# EasyEDA Pro project vector-06-easyeda.epro

# Schematic Schematic1
Board Name: Board1; Create Date: 2026-05-24; Page Name: P1; Project Name: odin8266; Schematic Name: Schematic1; Update Date: 2026-06-03; Company: EasyEDA.com; Page Size: A4; Version: V1.0
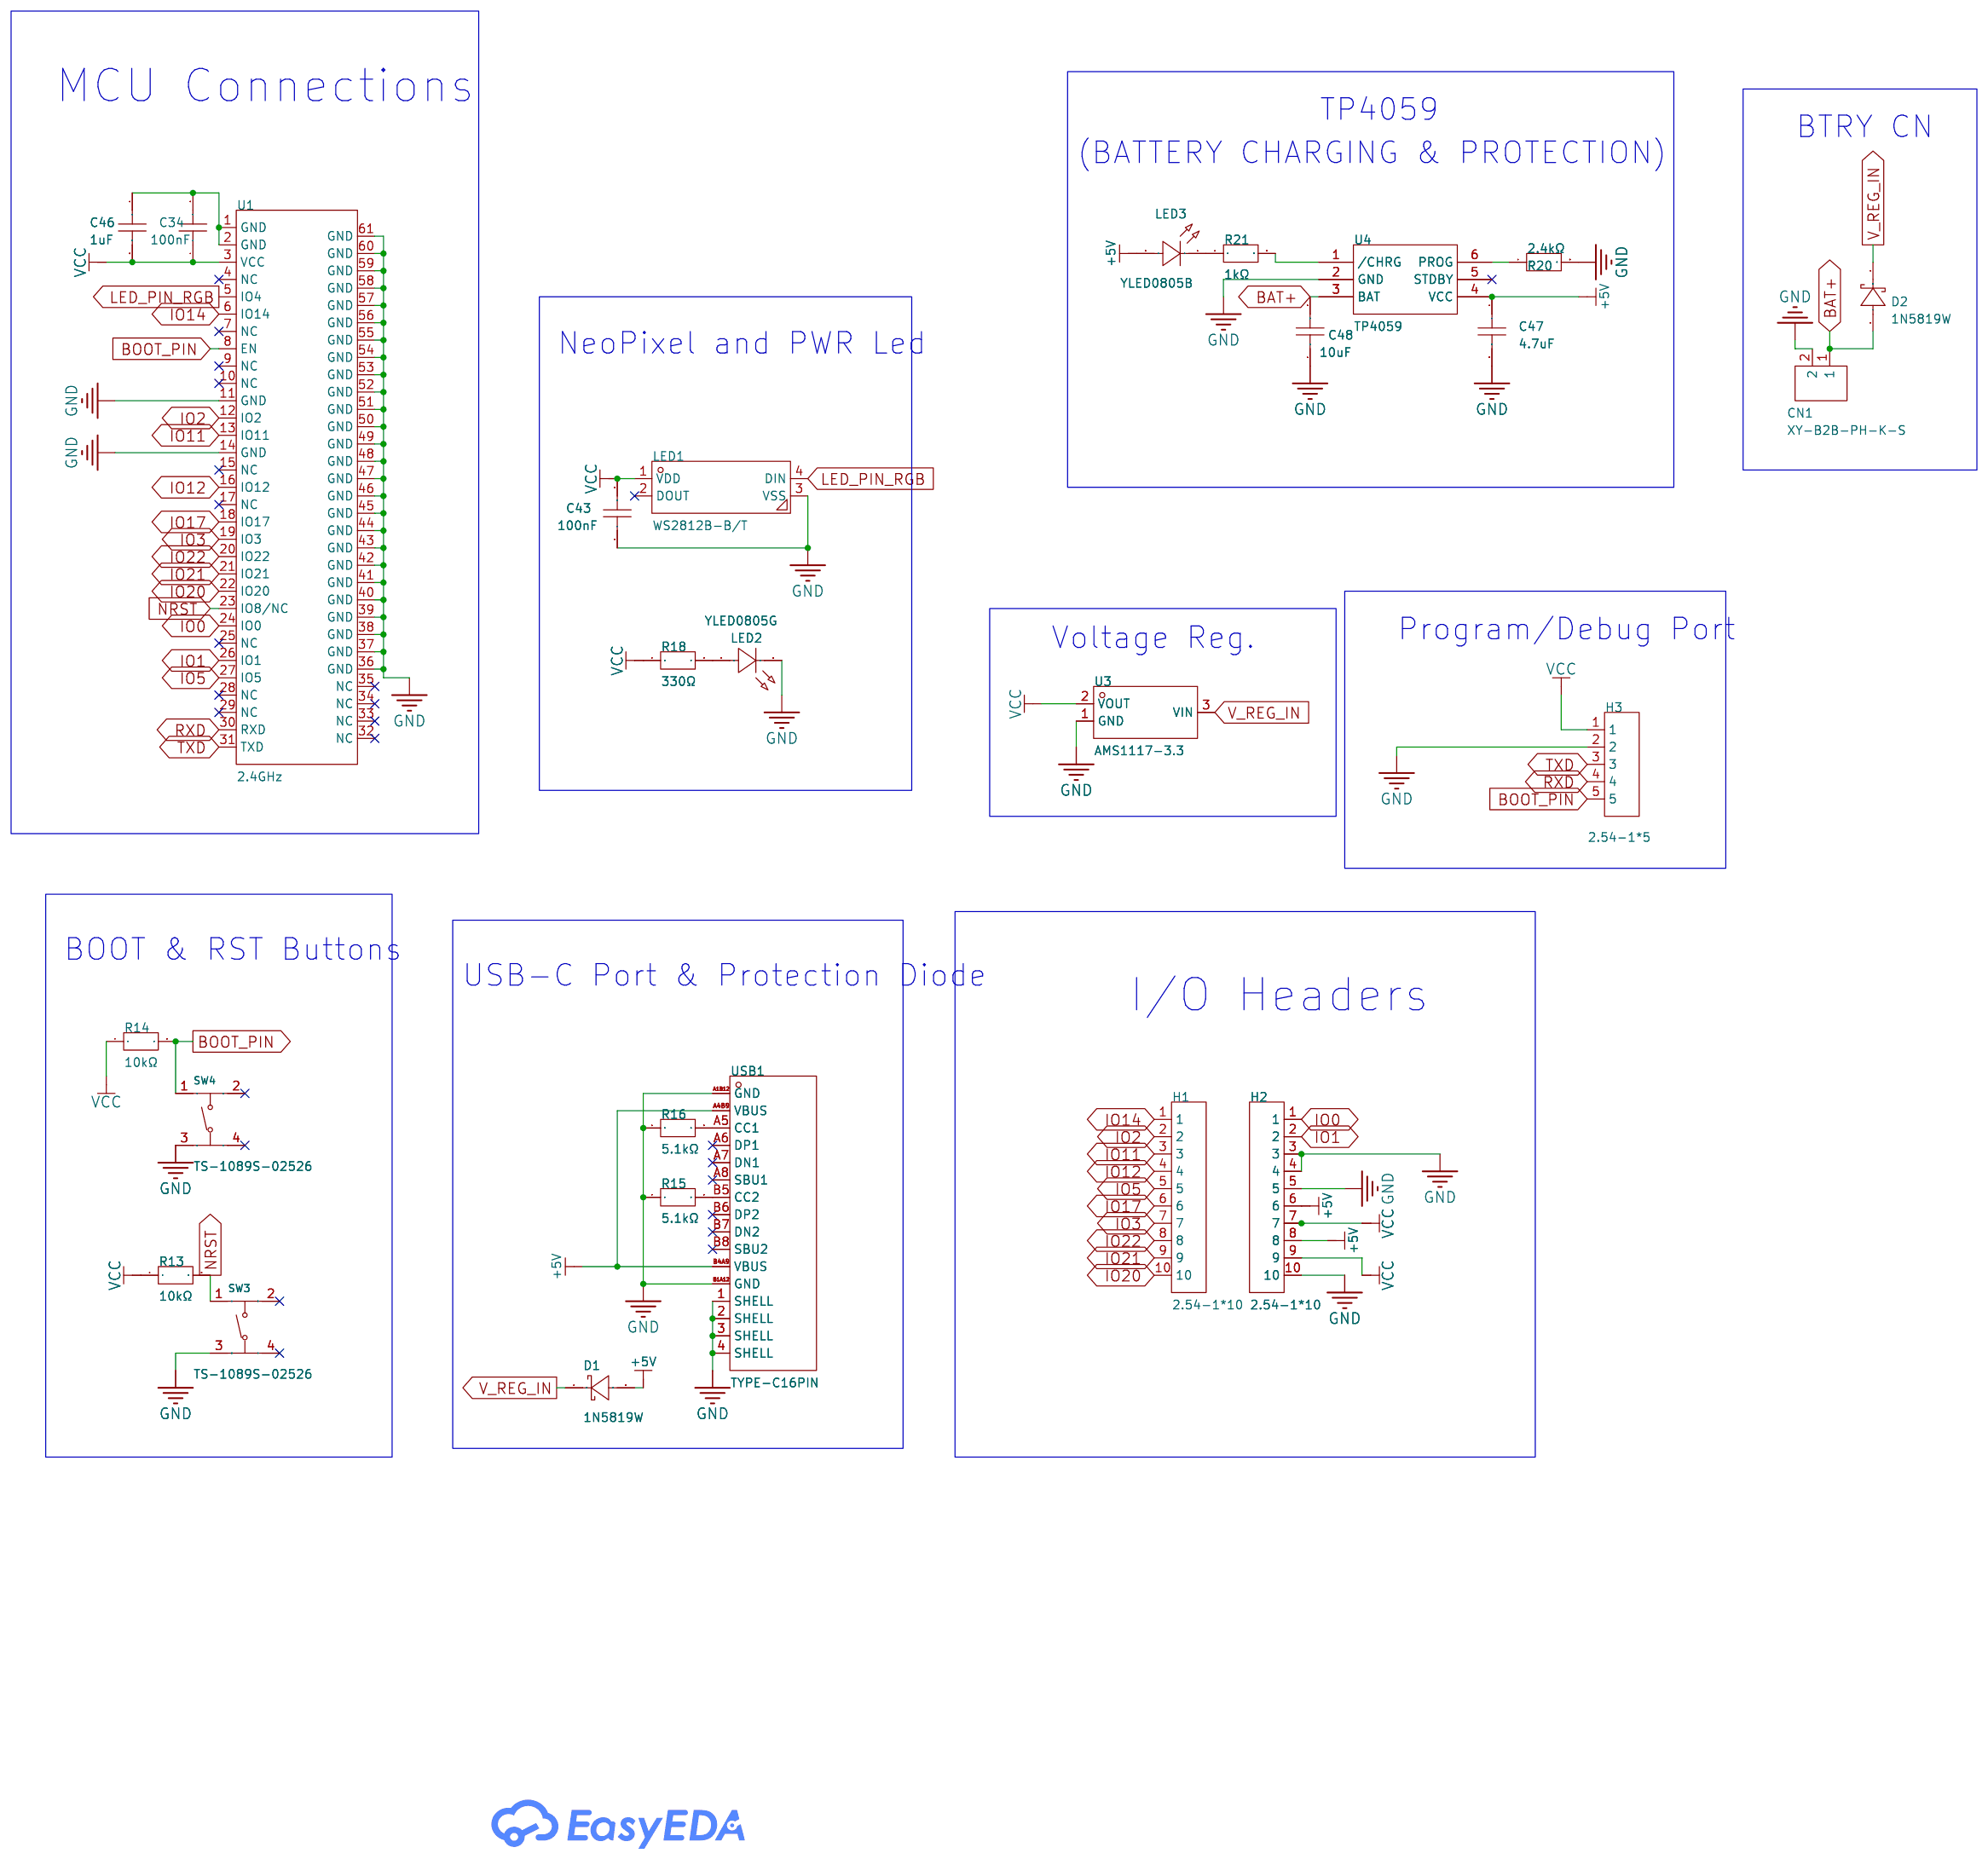
[diagram p0: schematic sheet]

## Parts
C34  100nF  [C0603]
C43  100nF  [C0603]
C46  1uF  [C0603]
C47  4.7uF  [C0603]
C48  10uF  [C0603]
CN1  XY-B2B-PH-K-S  [CONN-TH_B2B-PH-K-S]
D1  1N5819W  [SOD-123_L2.7-W1.6-LS3.7-RD]
D2  1N5819W  [SOD-123_L2.7-W1.6-LS3.7-RD]
H1  2.54-1*10  [HDR-TH_10P-P2.54-V-M]
H2  2.54-1*10  [HDR-TH_10P-P2.54-V-M]
H3  2.54-1*5  [HDR-TH_5P-P2.54-V-M]
LED1  WS2812B-B/T  [LED-SMD_4P-L5.0-W5.0-TL_WS2812B-B]
LED2  YLED0805G  [LED0805-FD-GREEN]
LED3  YLED0805B  [LED0805-RD]
R13  10kΩ  [R0603]
R14  10kΩ  [R0603]
R15  5.1kΩ  [R0603]
R16  5.1kΩ  [R0603]
R18  330Ω  [R0603]
R20  2.4kΩ  [R0603]
R21  1kΩ  [R0603]
SW3  TS-1089S-02526  [SW-SMD_4P-L4.2-W3.3-P2.15-LS5.1]
SW4  TS-1089S-02526  [SW-SMD_4P-L4.2-W3.3-P2.15-LS5.1]
U1  2.4GHz  [WIFIM-SMD_61P-CUSTOMBRUH]
U3  AMS1117-3.3  [SOT-223-3_L6.5-W3.4-P2.30-LS7.0-BR-1]
U4  TP4059  [SOT-23-6_L2.9-W1.6-P0.95-LS2.8-BR]
USB1  TYPE-C16PIN  [USB-C-SMD_TYPE-C16PIN]

## Library data of the parts
C34 C43 = FCC0603B104K500CT: Capacitance:100nF Tolerance:±10% Tolerance:±10% Voltage Rating:50V Temperature Coefficient:X7R; LCSC Part Name: 100nF ±10% 50V; Supplier Part: C5137636; Manufacturer: FOJAN(富捷); Supplier Footprint: 0603; JLCPCB Part Class: Extended Part; Datasheet: https://item.szlcsc.com/datasheet/FCC0603B104K500CT/5747088.html; Supplier: LCSC; Tolerance: ±10%; Voltage Rating: 50V; Temperature Coefficient: X7R
C46 = CGA0603X5R105K500JT: Capacitance:1uF Tolerance:±10% Tolerance:±10% Voltage Rating:50V Temperature Coefficient:X5R; LCSC Part Name: 1uF ±10% 50V; Supplier Part: C6119852; Manufacturer: HRE(芯声); Supplier Footprint: 0603; JLCPCB Part Class: Extended Part; Datasheet: https://item.szlcsc.com/datasheet/CGA0603X5R105K500JT/7062558.html; Supplier: LCSC; Tolerance: ±10%; Voltage Rating: 50V; Temperature Coefficient: X5R
C47 = TCC0603X5R475K160CT: Capacitance:4.7uF Tolerance:±10% Tolerance:±10% Voltage Rating:16V Temperature Coefficient:X5R; LCSC Part Name: 4.7uF ±10% 16V; Supplier Part: C380325; Manufacturer: CCTC(三环); Supplier Footprint: 0603; JLCPCB Part Class: Extended Part; Datasheet: https://item.szlcsc.com/datasheet/TCC0603X5R475K160CT/352730.html; Supplier: LCSC; Tolerance: ±10%; Voltage Rating: 16V; Temperature Coefficient: X5R
C48 = TCC0603X5R106K100CT: Capacitance:10uF Tolerance:±10% Tolerance:±10% Voltage Rating:10V Temperature Coefficient:X5R; LCSC Part Name: 10uF ±10% 10V; Supplier Part: C380314; Manufacturer: CCTC(三环); Supplier Footprint: 0603; JLCPCB Part Class: Extended Part; Datasheet: https://item.szlcsc.com/datasheet/TCC0603X5R106K100CT/352719.html; Supplier: LCSC; Tolerance: ±10%; Voltage Rating: 10V; Temperature Coefficient: X5R
CN1 = XY-B2B-PH-K-S: Pins Structure:1x2P Pitch:2mm Mounting Type:- Reference Series:- Number of Pins:2P Number of Rows:1 Number of PINs Per Row:2 Row Spacing:- Current Rating:2A Contact Material:Brass Contact Plating:Tin Operating Temperature:-25℃~+85℃ Operating Temperature:-; LCSC Part Name: 1x2P 间距:2mm; Supplier Part: C51940125; Manufacturer: XYECONN(辛译); Supplier Footprint: 插件,P=2mm; JLCPCB Part Class: Extended Part; Supplier: LCSC; Pins Structure: 1x2P; Pitch: 2mm; Number of Pins: 2P; Number of Rows: 1; Number of PINs Per Row: 2; Current Rating: 2A; Contact Material: Brass; Contact Plating: Tin; Operating Temperature: -25℃~+85℃; Voltage Rating: 250V; Plastic Material: PA66; Flame Retardant Rating: UL94V-0; Color: White
D1 D2 = 1N5819W_C41431973: Diode Configuration:Independent Voltage - Forward(Vf@If):580mV@1A Voltage - DC Reverse(Vr):40V Current - Rectified:1A Reverse Leakage Current (Ir):50uA@40V Operating Junction Temperature Range:-65℃~+125℃ Operating Junction Temperature Range:-65℃~+125℃ Non; LCSC Part Name: 丝印SL，1A 电压:40V 电流:1A; Supplier Part: C41431973; Manufacturer: GOODWORK(固得沃克); Supplier Footprint: SOD-123; JLCPCB Part Class: Extended Part; Datasheet: https://item.szlcsc.com/datasheet/1N5819W/43290188.html; Supplier: LCSC; Diode Configuration: Independent; Voltage - Forward(Vf@If): 580mV@1A; Voltage - DC Reverse(Vr): 40V; Current - Rectified: 1A; Reverse Leakage Current (Ir): 50uA@40V; Operating Junction Temperature Range: -65℃~+125℃; Non-Repetitive Peak Forward Surge Current: 9A
H1 H2 = 2.54-1*10: Pin Structure:1x10P Pitch:2.54mm Circluar Pins/Square Pins:Pin Header Mounting Type:Through Hole Number of Rows:1 Number of Pins:10P Current Rating:2.5A Length of Mating Pin:6mm Insulation Height:2.54mm Length of End Connection Pin:3mm Contact Material:Br; LCSC Part Name: 1x10P 间距:2.54mm 方针 直插; Supplier Part: C5156617; Manufacturer: ZHOURI(洲日); Supplier Footprint: 插件,P=2.54mm; JLCPCB Part Class: Extended Part; Datasheet: https://item.szlcsc.com/datasheet/2.54-1*10/5790717.html; Supplier: LCSC; Pin Structure: 1x10P; Pitch: 2.54mm; Circluar Pins/Square Pins: Pin Header; Mounting Type: Through Hole; Number of Rows: 1; Number of Pins: 10P; Current Rating: 2.5A; Length of Mating Pin: 6mm; Insulation Height: 2.54mm; Length of End Connection Pin: 3mm; Contact Material: Brass; Contact Plating: Gold; Operating Temperature: -40℃~+105℃
H3 = 2.54-1*5: Pin Structure:1x5P Pitch:2.54mm Circluar Pins/Square Pins:Pin Header Mounting Type:Through Hole Number of Rows:1 Number of Pins:5P Current Rating:2.5A Length of Mating Pin:6mm Insulation Height:2.54mm Length of End Connection Pin:3mm Contact Material:Bras; LCSC Part Name: 1x5P 间距:2.54mm 方针 直插; Supplier Part: C5156614; Manufacturer: ZHOURI(洲日); Supplier Footprint: 插件,P=2.54mm; JLCPCB Part Class: Extended Part; Datasheet: https://item.szlcsc.com/datasheet/2.54-1*5/5790714.html; Supplier: LCSC; Pin Structure: 1x5P; Pitch: 2.54mm; Circluar Pins/Square Pins: Pin Header; Mounting Type: Through Hole; Number of Rows: 1; Number of Pins: 5P; Current Rating: 2.5A; Length of Mating Pin: 6mm; Insulation Height: 2.54mm; Length of End Connection Pin: 3mm; Contact Material: Brass; Contact Plating: Gold; Operating Temperature: -40℃~+105℃
LED1 = WS2812B-B/T: Wavelength:520nm；471nm；621nm Luminous Intensity:R:300mcd~500mcd；B:200mcd~300mcd；G:600mcd~1000mcd Fixed-Frequency Pwm Mode:2kHz Data Transmission Rate:800Kbit/s Voltage - Supply:- Voltage - Supply:- Quiescent Current:0.6mA Lens Color:- Peak Wavelength:G:52; LCSC Part Name: RGB三色; Supplier Part: C2761795; Manufacturer: worldsemi; Supplier Footprint: SMD5050-4P; JLCPCB Part Class: Extended Part; Datasheet: https://item.szlcsc.com/datasheet/WS2812B-B%252FT/2886707.html; Supplier: LCSC; Wavelength: 520nm；471nm；621nm; Luminous Intensity: R:300mcd~500mcd；B:200mcd~300mcd；G:600mcd~1000mcd; Fixed-Frequency Pwm Mode: 2kHz; Data Transmission Rate: 800Kbit/s; Quiescent Current: 0.6mA; Peak Wavelength: G:520nm；R:621nm；B:471nm; Length: 5mm; Width: 1.57mm; Height: 5.4mm
LED2 = YLED0805G: Lamp Holder Type:2mm x 1.25mm square LED Illumination Color:Emerald Green Voltage - Forward(Vf):2.4V~3.1V Voltage - Forward(Vf):2.4V~3.1V Power(Watts):70mW Forward Current:20mA Wavelength - Dominant:516nm~534nm Wavelength - Dominant:516nm~534nm Peak Wavel; LCSC Part Name: 发光管; Supplier Part: C25170728; Manufacturer: YONGYUTAI(永裕泰); Supplier Footprint: 0805; JLCPCB Part Class: Extended Part; Datasheet: https://item.szlcsc.com/datasheet/YLED0805G/26899175.html; Supplier: LCSC; Lamp Holder Type: 2mm x 1.25mm square LED; Illumination Color: Emerald Green; Voltage - Forward(Vf): 2.4V~3.1V; Power(Watts): 70mW; Forward Current: 20mA; Wavelength - Dominant: 516nm~534nm; Peak Wavelength: 525nm; Diode Configuration: Discrete Diode; Lens Color: Water Clear; Luminous Intensity: 430mcd; Viewing Angle: 120°; Operating Temperature: -40℃~+85℃
LED3 = YLED0805B: Lamp Holder Type:- Illumination Color:Blue Voltage - Forward(Vf):2.7V~3.1V Voltage - Forward(Vf):2.7V~3.1V Power(Watts):- Forward Current:25mA Wavelength - Dominant:457nm~475nm Wavelength - Dominant:457nm~475nm Peak Wavelength:- Diode Configuration:Discre; LCSC Part Name: 蓝色 独立二极管; Supplier Part: C19273154; Manufacturer: YONGYUTAI(永裕泰); Supplier Footprint: 0805; JLCPCB Part Class: Extended Part; Datasheet: https://item.szlcsc.com/datasheet/YLED0805B/20555408.html; Supplier: LCSC; Illumination Color: Blue; Voltage - Forward(Vf): 2.7V~3.1V; Forward Current: 25mA; Wavelength - Dominant: 457nm~475nm; Diode Configuration: Discrete Diode; Luminous Intensity: 80mcd; Viewing Angle: 120°; Operating Temperature: -40℃~+85℃
R13 R14 = FRC0603J103 TS: Type:Thick Film Resistor Resistance:10kΩ Tolerance:±5% Tolerance:±5% Power(Watts):100mW Voltage-Supply(Max):75V Temperature Coefficient:±100ppm/℃ Temperature Coefficient:±100ppm/℃ Operating Temperature:-55℃~+155℃ Operating Temperature:-55℃~+155℃; LCSC Part Name: 10kΩ ±5% 100mW 厚膜电阻; Supplier Part: C2930027; Manufacturer: FOJAN(富捷); Supplier Footprint: 0603; JLCPCB Part Class: Extended Part; Datasheet: https://item.szlcsc.com/datasheet/FRC0603J103%2520TS/3266960.html; Supplier: LCSC; Type: Thick Film Resistor; Tolerance: ±5%; Power(Watts): 100mW; Voltage-Supply(Max): 75V; Temperature Coefficient: ±100ppm/℃; Operating Temperature: -55℃~+155℃
R15 R16 = FRC0603F5101TS: Type:Thick Film Resistor Resistance:5.1kΩ Tolerance:±1% Tolerance:±1% Power(Watts):100mW Voltage-Supply(Max):75V Temperature Coefficient:±100ppm/℃ Temperature Coefficient:±100ppm/℃ Operating Temperature:-55℃~+155℃ Operating Temperature:-55℃~+155℃; LCSC Part Name: 5.1kΩ ±1% 100mW 厚膜电阻; Supplier Part: C2907044; Manufacturer: FOJAN(富捷); Supplier Footprint: 0603; JLCPCB Part Class: Extended Part; Supplier: LCSC; Type: Thick Film Resistor; Tolerance: ±1%; Power(Watts): 100mW; Voltage-Supply(Max): 75V; Temperature Coefficient: ±100ppm/℃; Operating Temperature: -55℃~+155℃
R18 = FRC0603J331 TS: Type:Thick Film Resistor Resistance:330Ω Tolerance:±5% Tolerance:±5% Power(Watts):100mW Voltage-Supply(Max):75V Temperature Coefficient:±100ppm/℃ Temperature Coefficient:±100ppm/℃ Operating Temperature:-55℃~+155℃ Operating Temperature:-55℃~+155℃; LCSC Part Name: 330Ω ±5% 100mW 厚膜电阻; Supplier Part: C2907152; Manufacturer: FOJAN(富捷); Supplier Footprint: 0603; JLCPCB Part Class: Extended Part; Supplier: LCSC; Type: Thick Film Resistor; Tolerance: ±5%; Power(Watts): 100mW; Voltage-Supply(Max): 75V; Temperature Coefficient: ±100ppm/℃; Operating Temperature: -55℃~+155℃
R20 = FRC0603F2401TS: Type:Thick Film Resistor Resistance:2.4kΩ Tolerance:±1% Tolerance:±1% Power(Watts):100mW Voltage-Supply(Max):75V Temperature Coefficient:±100ppm/℃ Temperature Coefficient:±100ppm/℃ Operating Temperature:-55℃~+155℃ Operating Temperature:-55℃~+155℃; LCSC Part Name: 2.4kΩ ±1% 100mW 厚膜电阻; Supplier Part: C2907007; Manufacturer: FOJAN(富捷); Supplier Footprint: 0603; JLCPCB Part Class: Extended Part; Supplier: LCSC; Type: Thick Film Resistor; Tolerance: ±1%; Power(Watts): 100mW; Voltage-Supply(Max): 75V; Temperature Coefficient: ±100ppm/℃; Operating Temperature: -55℃~+155℃
R21 = FRC0603J102 TS: Type:Thick Film Resistor Resistance:1kΩ Tolerance:±5% Tolerance:±5% Power(Watts):100mW Voltage-Supply(Max):75V Temperature Coefficient:±100ppm/℃ Temperature Coefficient:±100ppm/℃ Operating Temperature:-55℃~+155℃ Operating Temperature:-55℃~+155℃; LCSC Part Name: 1kΩ ±5% 100mW 厚膜电阻; Supplier Part: C2907113; Manufacturer: FOJAN(富捷); Supplier Footprint: 0603; JLCPCB Part Class: Extended Part; Supplier: LCSC; Type: Thick Film Resistor; Tolerance: ±5%; Power(Watts): 100mW; Voltage-Supply(Max): 75V; Temperature Coefficient: ±100ppm/℃; Operating Temperature: -55℃~+155℃
SW3 SW4 = TS-1089S-02526: Circuit:SPST Actuator Style:Oval button Mounting Style:Brick nogging Switch Length:4.2mm Switch Width:3.25mm Switch Height:2.5mm Contact Current:50mA Voltage Rating (DC):12V With Lamp:- Mechanical Life:-; LCSC Part Name: 4.2*3.25*2.5mm 立贴 轻触开关; Supplier Part: C455282; Manufacturer: XUNPU(讯普); Supplier Footprint: SMD,3.3x4.2mm; JLCPCB Part Class: Extended Part; Datasheet: https://atta.szlcsc.com/upload/public/pdf/source/20191118/C455282_2E86A26A9CC4FEF4662951C4D45ED672.pdf; Supplier: LCSC; Circuit: SPST; Actuator Style: Oval button; Mounting Style: Brick nogging; Switch Length: 4.2mm; Switch Width: 3.25mm; Switch Height: 2.5mm; Contact Current: 50mA; Voltage Rating (DC): 12V
U1 = Ai-WB2-M1-I: Utilized IC / Part:BL602 chip Wireless Standard:802.11b/g/n；BLE5.0 Interface Type:I2C；GPIO；UART；DAC；PWM；SPI；ADC Frequency:2.4GHz Antenna Type:IPEX interface Output Power:16dBm Output Power:16dBm Voltage - Supply:3.3V Voltage - Supply:3.3V Receive  Current; LCSC Part Name: Ai- WB2- M1-I; Supplier Part: C5187547; Manufacturer: Ai-Thinker(安信可); Supplier Footprint: SMD-61P; JLCPCB Part Class: Extended Part; Datasheet: https://atta.szlcsc.com/upload/public/pdf/source/20221011/8746CAA761288EB57CDC5EFA4B2B3F8E.pdf; Supplier: LCSC; Utilized IC / Part: BL602 chip; Wireless Standard: 802.11b/g/n；BLE5.0; Interface Type: I2C；GPIO；UART；DAC；PWM；SPI；ADC; Antenna Type: IPEX interface; Output Power: 16dBm; Voltage - Supply: 3.3V; Receive  Current: 64mA; Send  Current: 308mA; Sensitivity: -98dBm; Operating Temperature: -40℃~+85℃
U3 = AMS1117-3.3_C22459274: Output Type:Fixed Voltage - Supply:12V Output Voltage:3.3V Output Voltage:3.3V Output Current:1A Power Supply Rejection Ratio (PSRR):70dB@(120Hz) Voltage Dropout:1.4V@(1A) standby current:- Features:Over Temperature Protection；Over Current Protection Oper; LCSC Part Name: 1A低压差线性稳压器; Supplier Part: C22459274; Manufacturer: 晶扬电子; Supplier Footprint: SOT-223; JLCPCB Part Class: Extended Part; Datasheet: https://item.szlcsc.com/datasheet/AMS1117-3.3/24135194.html; Supplier: LCSC; Output Type: Fixed; Voltage - Supply: 12V; Output Voltage: 3.3V; Output Current: 1A; Power Supply Rejection Ratio (PSRR): 70dB@(120Hz); Voltage Dropout: 1.4V@(1A); Features: Over Temperature Protection；Over Current Protection; Operating Temperature: -40℃~+125℃@(Tj); Output Configuration: Positive; Number of Outputs: 1
U4 = TP4059: The Chip Type:Charging IC Voltage - Supply:4V~9V Voltage - Supply:4V~9V Charge Current - Max:600mA Charging Saturation Voltage:4.2V End-Off Voltage:- Type of Battery:Lithium Battery Number of Cells:1 Number of Cells:1 Operating Temperature:-40℃~+85℃ Opera; LCSC Part Name: 600mA单节锂离子电池充电器; Supplier Part: C80364; Manufacturer: TOPPOWER(南京拓微); Supplier Footprint: SOT-23-6; JLCPCB Part Class: Extended Part; Datasheet: https://item.szlcsc.com/datasheet/TP4059/81510.html; Supplier: LCSC; The Chip Type: Charging IC; Voltage - Supply: 4V~9V; Charge Current - Max: 600mA; Charging Saturation Voltage: 4.2V; Type of Battery: Lithium Battery; Number of Cells: 1; Operating Temperature: -40℃~+85℃; Battery Temperature Detection: Not supported; Supply Current (Iq): 2uA; Features: Constant voltage charging；Constant current charging；Automatic recharge；Charge termination；Programmable charging current；Undervoltage lockout；Trickle charging
USB1 = TYPE-C16PIN: Connector Type:Type-C Protocol Standard:- Gender:Female Mounting Type:Surface Mount, Right Angle Number of Contacts:16P Number of Ports:1 Current Rating-Power:3A Voltage Rating:30V Connect-Disconnect Life:10,000 Cycles Supplementary Features:- Center Heig; LCSC Part Name: 16P卧贴母座; Supplier Part: C393939; Manufacturer: SHOU HAN(首韩); Supplier Footprint: SMD; JLCPCB Part Class: Extended Part; Datasheet: https://item.szlcsc.com/datasheet/TYPE-C16PIN/372551.html; Supplier: LCSC; Connector Type: Type-C; Gender: Female; Mounting Type: Surface Mount, Right Angle; Number of Contacts: 16P; Number of Ports: 1; Current Rating-Power: 3A; Voltage Rating: 30V; Connect-Disconnect Life: 10,000 Cycles; Detection color: Black; Operating Temperature: -40℃~+85℃

## Nets
+5V: C47.1 D1.2(A) H2.6 H2.8 LED3.2(A) U4.4(VCC) USB1.A4B9(VBUS) USB1.B4A9(VBUS)
GND: C43.1 C47.2 C48.1 CN1.2 H2.3 H2.4 H2.5 H2.10 H3.2 LED1.3(VSS) LED2.2(K) R15.1 R16.1 R20.2 SW3.3 SW4.3 U1.11(GND) U1.14(GND) U1.36(GND) U1.37(GND) U1.38(GND) U1.39(GND) U1.40(GND) U1.41(GND) U1.42(GND) U1.43(GND) U1.44(GND) U1.45(GND) U1.46(GND) U1.47(GND) U1.48(GND) U1.49(GND) U1.50(GND) U1.51(GND) U1.52(GND) U1.53(GND) U1.54(GND) U1.55(GND) U1.56(GND) U1.57(GND) U1.58(GND) U1.59(GND) U1.60(GND) U1.61(GND) U3.1(GND) U4.2(GND) USB1.1(SHELL) USB1.2(SHELL) USB1.3(SHELL) USB1.4(SHELL) USB1.A1B12(GND) USB1.B1A12(GND)
VCC: C34.1 C43.2 C46.2 H2.7 H2.9 H3.1 LED1.1(VDD) R13.1 R14.1 R18.1 U1.3(VCC) U3.2(VOUT)
BAT+: C48.2 CN1.1 D2.2(A) U4.3(BAT)
BOOT_PIN: H3.5 R14.2 SW4.1 U1.8(EN)
IO0: H2.1 U1.24(IO0)
IO1: H2.2 U1.26(IO1)
IO2: H1.2 U1.12(IO2)
IO3: H1.7 U1.19(IO3)
IO5: H1.5 U1.27(IO5)
IO11: H1.3 U1.13(IO11)
IO12: H1.4 U1.16(IO12)
IO14: H1.1 U1.6(IO14)
IO17: H1.6 U1.18(IO17)
IO20: H1.10 U1.22(IO20)
IO21: H1.9 U1.21(IO21)
IO22: H1.8 U1.20(IO22)
LED_PIN_RGB: LED1.4(DIN) U1.5(IO4)
NRST: R13.2 SW3.1 U1.23(IO8/NC)
RXD: H3.4 U1.30(RXD)
TXD: H3.3 U1.31(TXD)
V_REG_IN: D1.1(C) D2.1(C) U3.3(VIN)
$1N1250: C34.2 C46.1 U1.1(GND) U1.2(GND)
$1N2534: R15.2 USB1.B5(CC2)
$1N2536: R16.2 USB1.A5(CC1)
$1N5981: LED2.1(A) R18.2
$1N8602: R21.2 U4.1(/CHRG)
$1N8604: LED3.1(K) R21.1
$1N8891: R20.1 U4.6(PROG)

Not connected (* = marked no-connect by the designer): LED1 2(DOUT)*; SW3 2* 4*; SW4 2* 4*; U1 4(NC)* 7(NC)* 9(NC)* 10(NC)* 15(NC)* 17(NC)* 25(NC)* 28(NC)* 29(NC)* 32(NC)* 33(NC)* 34(NC)* 35(NC)*; U4 5(STDBY)*; USB1 A6(DP1)* A7(DN1)* A8(SBU1)* B6(DP2)* B7(DN2)* B8(SBU2)*

## Notes on the sheet
- MCU Connections
- TP4059
- BTRY CN
- (BATTERY CHARGING & PROTECTION)
- NeoPixel and PWR Led
- Voltage Reg.
- Program/Debug Port
- BOOT & RST Buttons
- USB-C Port & Protection Diode
- I/O Headers
